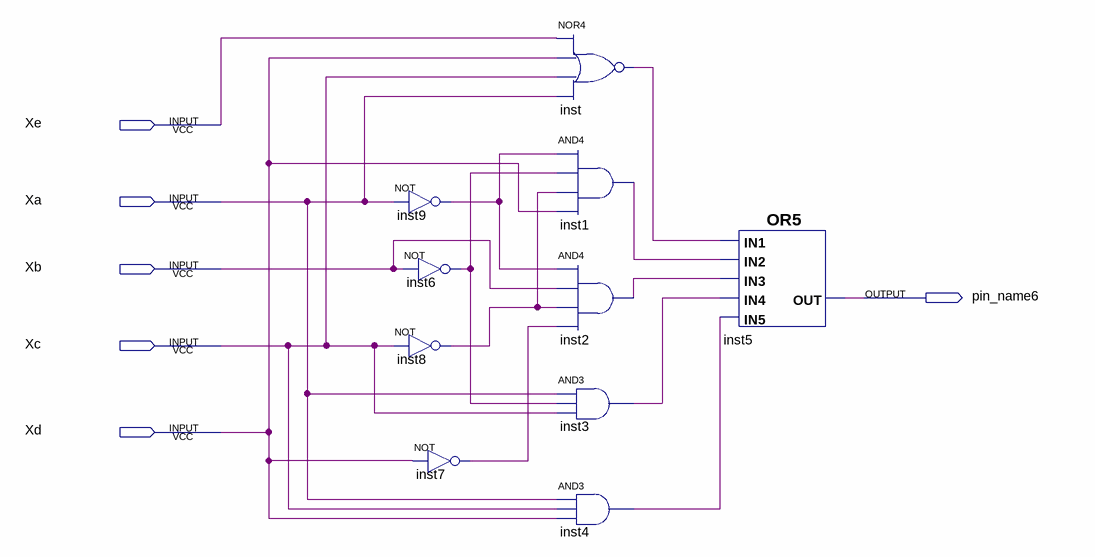
[diagram p0: schematic sheet]
// Quartus schematic Lab01.bdf as structural Verilog: 10 symbols, 6 pins
module Lab01 (
  input  Xe,
  input  Xa,
  input  Xb,
  input  Xc,
  input  Xd,
  output pin_name6
);

  wire inst1_out, inst2_out, inst3_out, inst4_out, inst6_out, inst7_out, inst8_out, inst9_out, inst_out;

  not inst9 (inst9_out, Xa);
  not inst6 (inst6_out, Xb);
  not inst8 (inst8_out, Xc);
  not inst7 (inst7_out, Xd);
  nor inst (inst_out, Xe, Xd, Xc, Xa);
  and inst1 (inst1_out, inst9_out, inst6_out, inst8_out, Xd);
  and inst2 (inst2_out, inst9_out, Xb, inst8_out, inst7_out);
  and inst3 (inst3_out, Xa, inst6_out, Xc);
  and inst4 (inst4_out, Xa, Xc, Xd);
  or inst5 (pin_name6, inst_out, inst1_out, inst2_out, inst3_out, inst4_out);
endmodule
